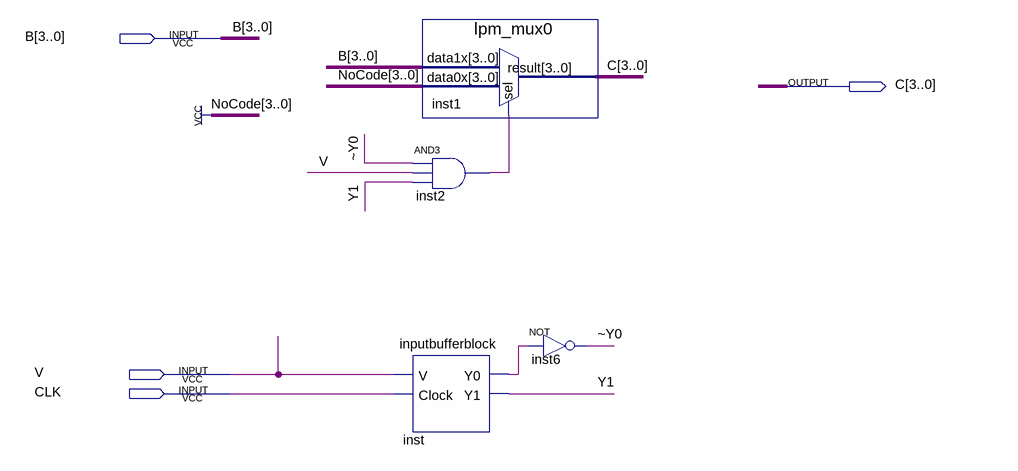
[diagram p0: schematic sheet]
// Quartus schematic inputbuffer.bdf as structural Verilog: 4 symbols, 4 pins
module inputbuffer (
  input  [3:0] B,
  input  V,
  input  CLK,
  output [3:0] C
);

  wire inst2_out, inst_y0, Y1, \~Y0 ;

  lpm_mux0 inst1 (.data1x(B), .data0x(4'b1111), .sel(inst2_out), .result(C));
  and inst2 (inst2_out, \~Y0 , V, Y1);
  inputbufferblock inst (.V(V), .Clock(CLK), .Y0(inst_y0), .Y1(Y1));
  not inst6 (\~Y0 , inst_y0);
endmodule
